# EasyEDA schematic Sheet_1.json
TITLE: nodemcu çalışma kartı; REV: v1.0; Date: 2021-06-24; Sheet: 1/1; Drawn By: EfeBostanci; Company: Your Company
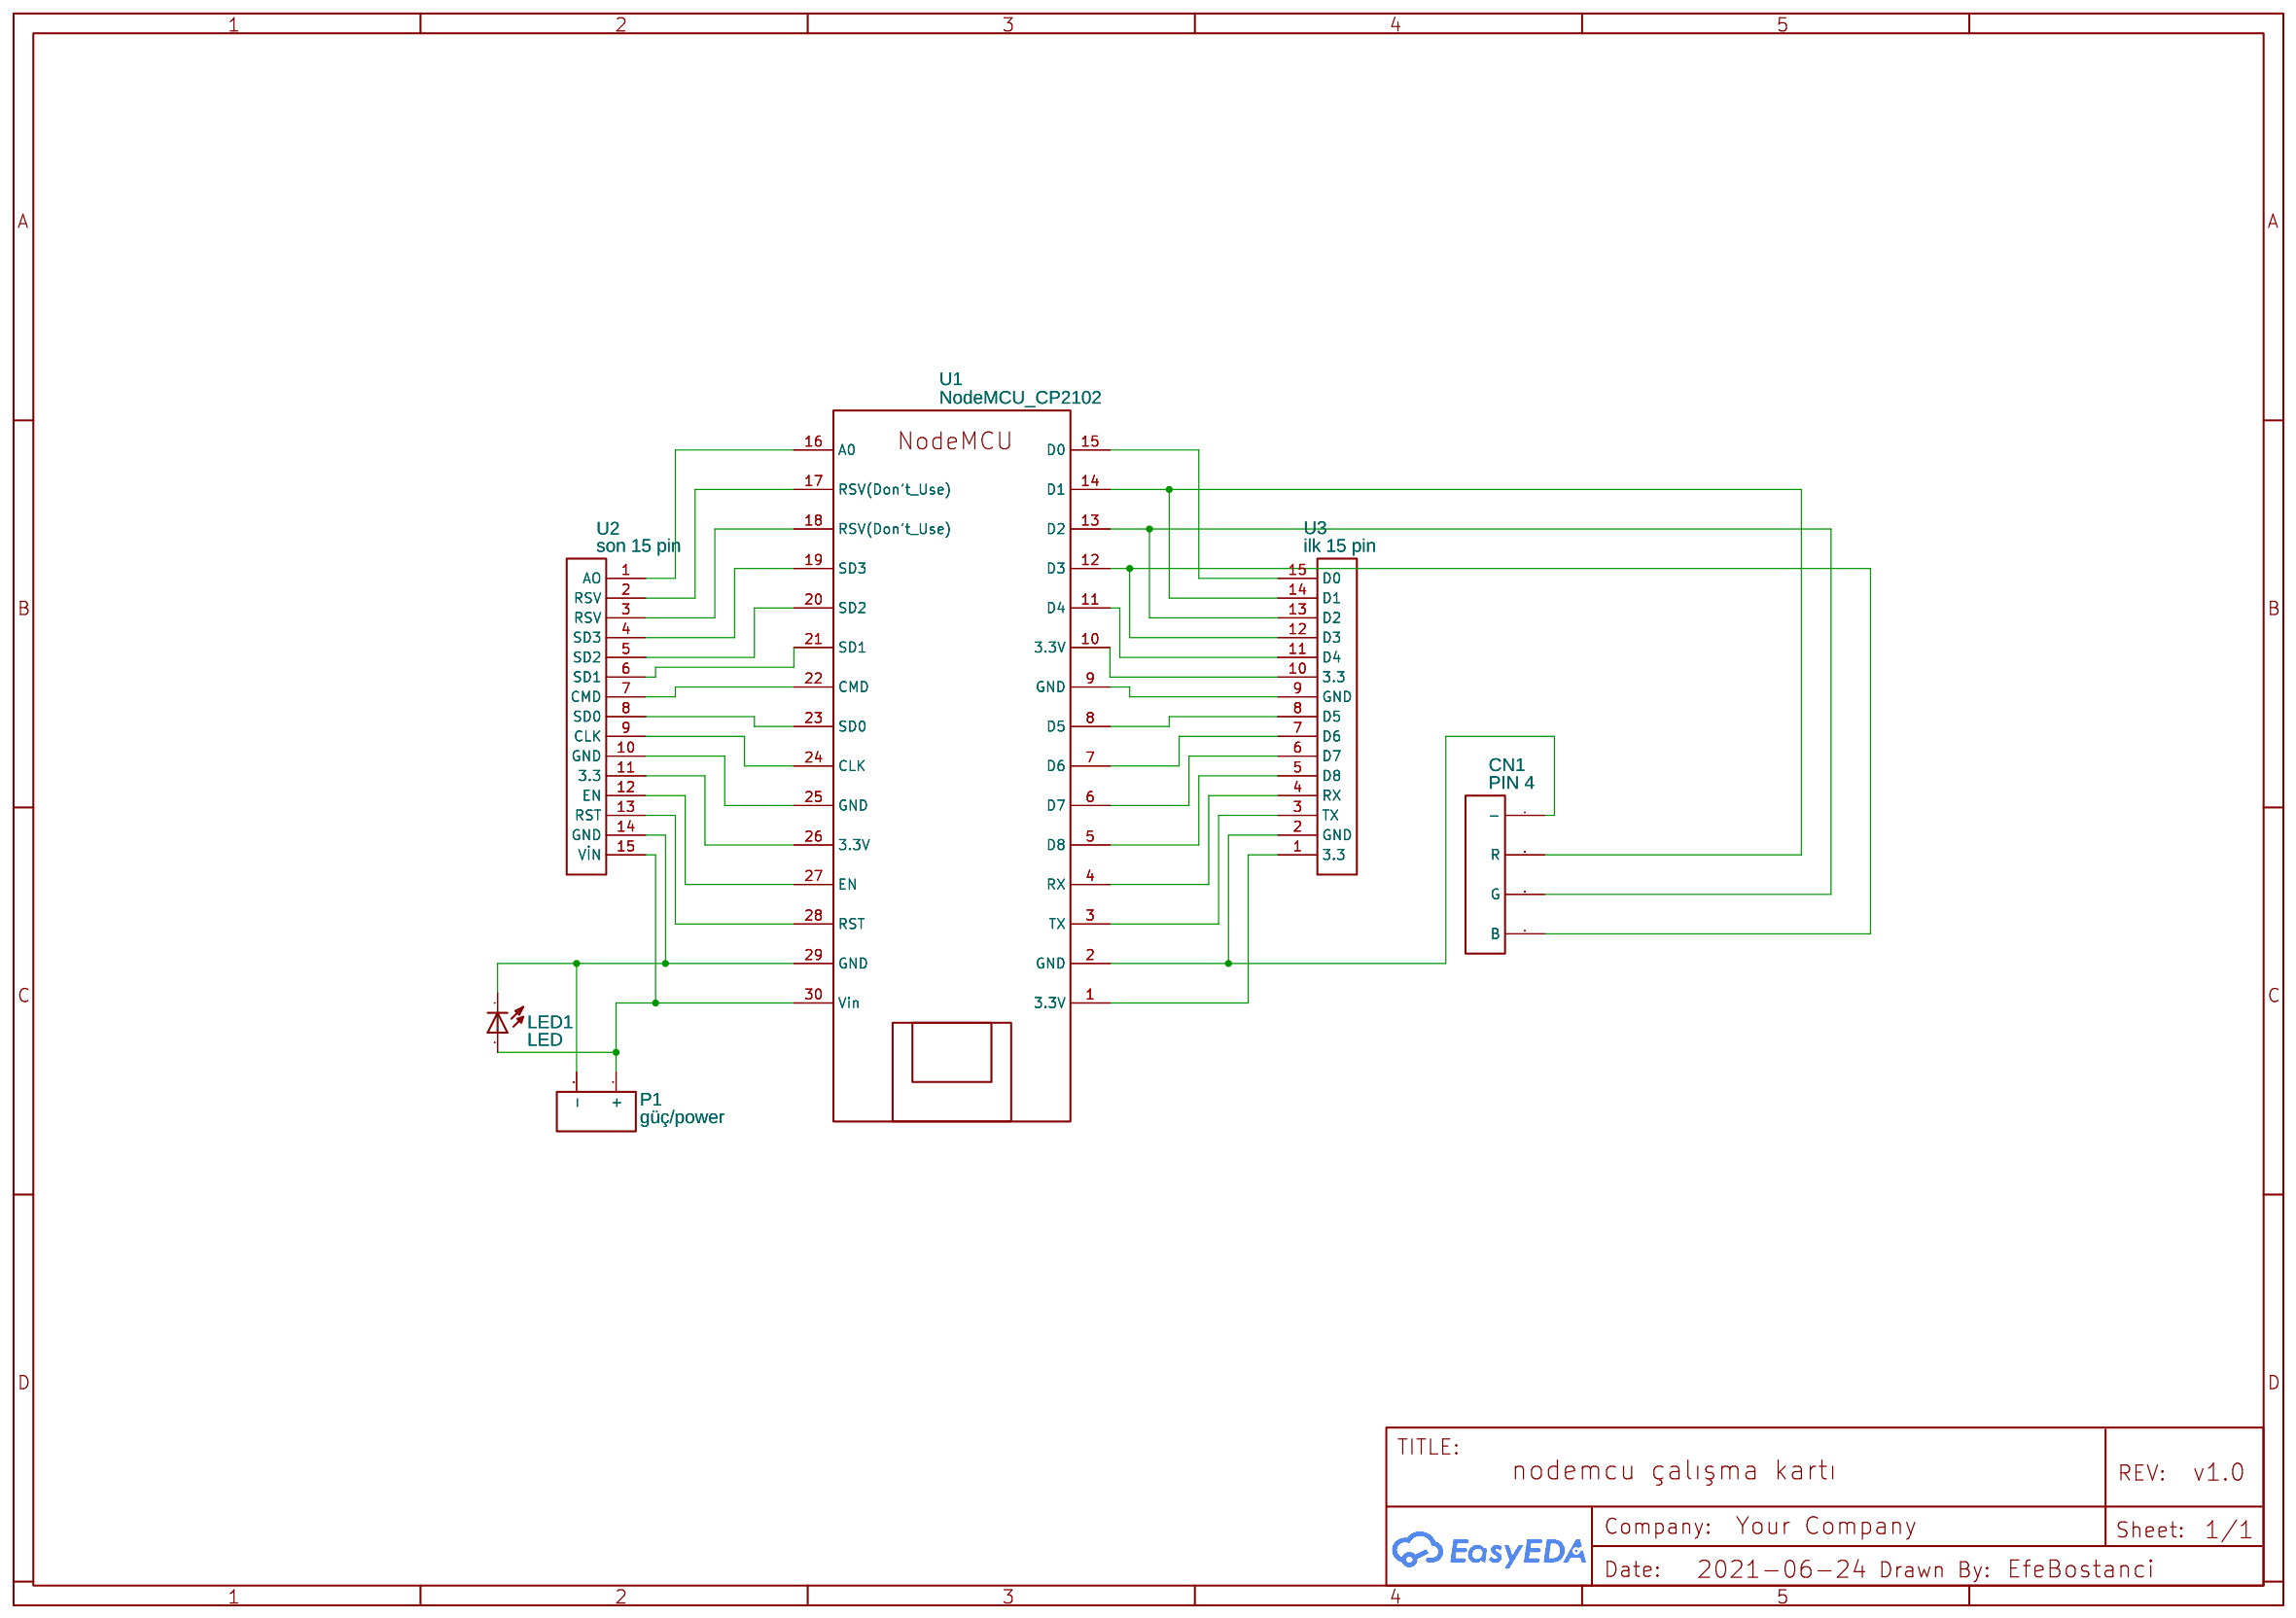
[diagram p0: schematic sheet]

## Parts
CN1  PIN 4  [PIN HEADER 4PIN]
LED1  LED  [SFH482]
P1  güç/power  [7.62_PCB_KLEMENS_2P]
U1  NodeMCU_CP2102  [NODEMCU_CP2102]
U2  son 15 pin  [15 PIN]
U3  ilk 15 pin  [15 PIN]

## Library data of the parts
CN1 = PIN 4: Contributor: Neuronio.Inc
LED1 = LED
P1 = Header_2.54_1x2: Supplier: LCSC; Manufacturer: walger; Manufacturer Part: Header-Female-2.54_1x4; Supplier Part: C124413; Contributor: kenankurt
U1 = NodeMCU_CP2102: Contributor: Vakhtang
U2 U3 = 15 pin: Contributor: franco.fumanti

## Nets
Net-(CN1-1): CN1.1(B) U1.12(D3) U3.12(D3)
Net-(CN1-2): CN1.2(G) U1.13(D2) U3.13(D2)
Net-(CN1-3): CN1.3(R) U1.14(D1) U3.14(D1)
Net-(CN1-4): CN1.4(-) U1.2(GND) U3.2(GND)
Net-(LED1-A): LED1.A P1.1(+) U1.30(Vin) U2.15(VİN)
Net-(LED1-K): LED1.K(C) P1.2(-) U1.29(GND) U2.14(GND)
Net-(U1-1): U1.1(3.3V) U3.1(3.3)
Net-(U1-3): U1.3(TX) U3.3(TX)
Net-(U1-4): U1.4(RX) U3.4(RX)
Net-(U1-5): U1.5(D8) U3.5(D8)
Net-(U1-6): U1.6(D7) U3.6(D7)
Net-(U1-7): U1.7(D6) U3.7(D6)
Net-(U1-8): U1.8(D5) U3.8(D5)
Net-(U1-9): U1.9(GND) U3.9(GND)
Net-(U1-10): U1.10(3.3V) U3.10(3.3)
Net-(U1-11): U1.11(D4) U3.11(D4)
Net-(U1-15): U1.15(D0) U3.15(D0)
Net-(U1-16): U1.16(A0) U2.1(AO)
Net-(U1-17): U1.17(RSV(Don't Use)) U2.2(RSV)
Net-(U1-18): U1.18(RSV(Don't Use)) U2.3(RSV)
Net-(U1-19): U1.19(SD3) U2.4(SD3)
Net-(U1-20): U1.20(SD2) U2.5(SD2)
Net-(U1-21): U1.21(SD1) U2.6(SD1)
Net-(U1-22): U1.22(CMD) U2.7(CMD)
Net-(U1-23): U1.23(SD0) U2.8(SD0)
Net-(U1-24): U1.24(CLK) U2.9(CLK)
Net-(U1-25): U1.25(GND) U2.10(GND)
Net-(U1-26): U1.26(3.3V) U2.11(3.3)
Net-(U1-27): U1.27(EN) U2.12(EN)
Net-(U1-28): U1.28(RST) U2.13(RST)
